# EAGLE design NanjaTown02 (EAGLE 9.2.2)
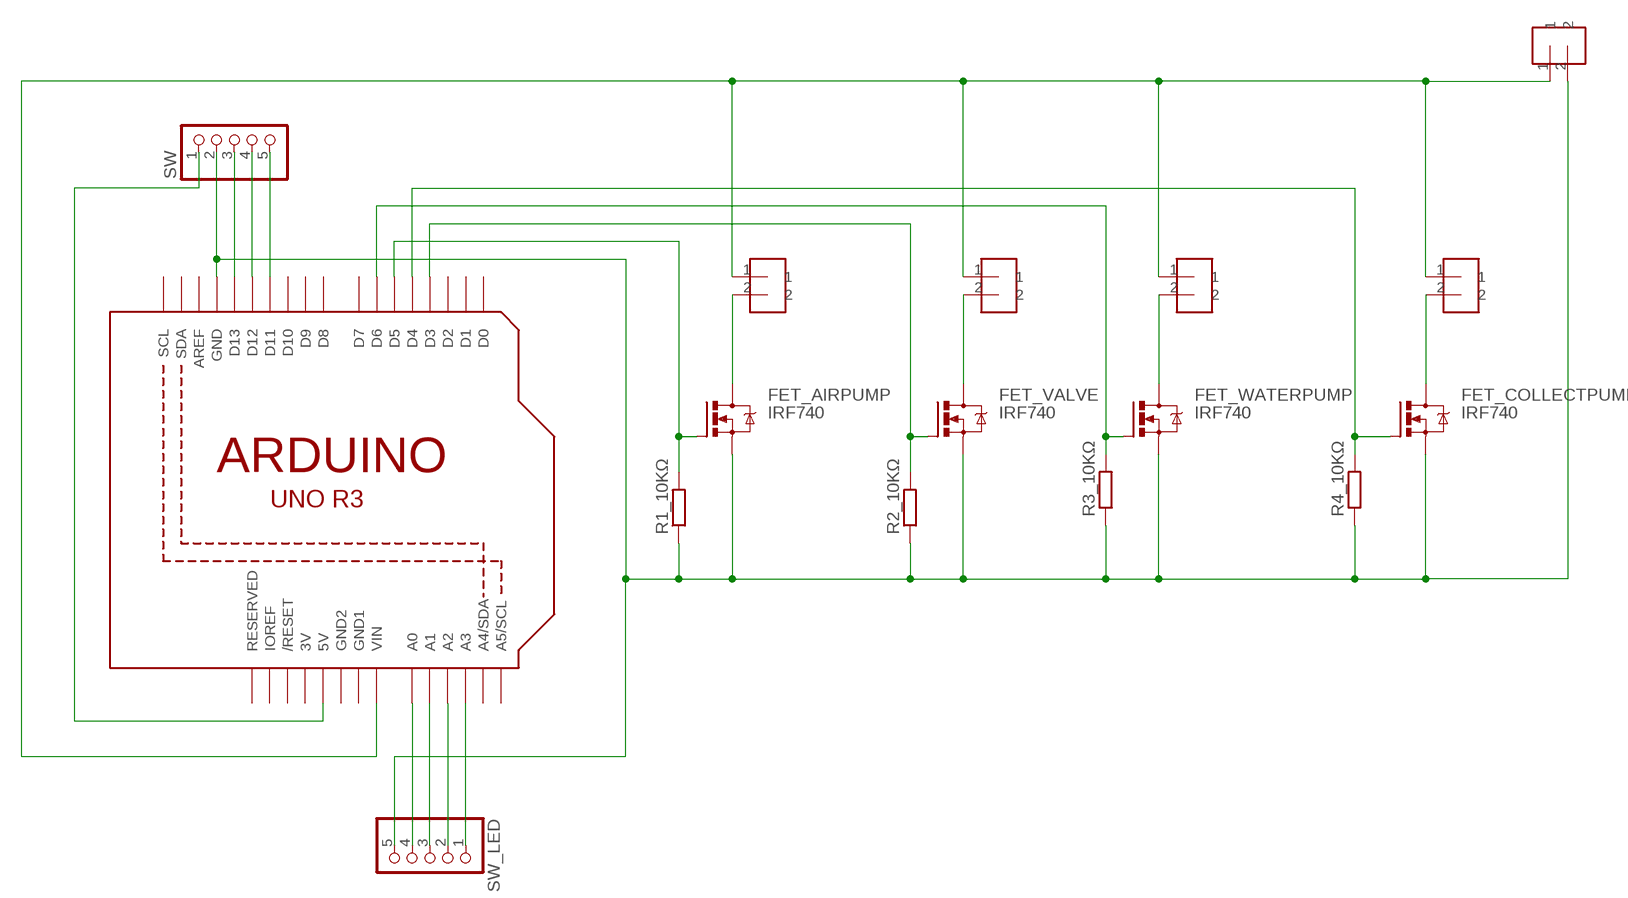
[diagram p0: schematic, sheet 1]

## Parts
FET_AIRPUMP  IRF740  [TO220BV]
FET_COLLECTPUMP  IRF740  [TO220BV]
FET_VALVE  IRF740  [TO220BV]
FET_WATERPUMP  IRF740  [TO220BV]
R1_10KΩ  R-EU_0207/10  [0207/10]
R2_10KΩ  R-EU_0207/10  [0207/10]
R3_10KΩ  R-EU_0207/10  [0207/10]
R4_10KΩ  R-EU_0207/10  [0207/10]
SW  PINHD-1X5  [1X05]
SW_LED  PINHD-1X5/90  [1X05/90]
TERMINAL_AIRPUMP  TERMINAL_BLOCK_5.08MM  [TERMINAL_BLOCK_5.8MM]
TERMINAL_COLLECTPUMP  TERMINAL_BLOCK_5.08MM  [TERMINAL_BLOCK_5.8MM]
TERMINAL_VALVE  TERMINAL_BLOCK_5.08MM  [TERMINAL_BLOCK_5.8MM]
TERMINAL_WATERPUMP  TERMINAL_BLOCK_5.08MM  [TERMINAL_BLOCK_5.8MM]
U1  ARDUINOR3-DIMENSION  [ARDUINOR3]
U$1  TERMINAL_BLOCK_5.08MM  [TERMINAL_BLOCK_5.8MM]

## Nets
N$1: FET_AIRPUMP.G R1_10KΩ.2 U1.D5
N$2: FET_VALVE.G R2_10KΩ.2 U1.D3
N$3: FET_WATERPUMP.G R3_10KΩ.2 U1.D6
N$4: FET_COLLECTPUMP.G R4_10KΩ.2 U1.D4
N$6 [vcc_gnd]: TERMINAL_AIRPUMP.1 TERMINAL_COLLECTPUMP.1 TERMINAL_VALVE.1 TERMINAL_WATERPUMP.1 U1.VIN U$1.1
N$7: FET_AIRPUMP.D TERMINAL_AIRPUMP.2
N$8: FET_VALVE.D TERMINAL_VALVE.2
N$9: FET_WATERPUMP.D TERMINAL_WATERPUMP.2
N$10: FET_COLLECTPUMP.D TERMINAL_COLLECTPUMP.2
N$11: SW_LED.4 U1.A0
N$12: SW_LED.3 U1.A1
N$13: SW_LED.2 U1.A2
N$14: SW_LED.1 U1.A3
N$15 [vcc_gnd]: FET_AIRPUMP.S FET_COLLECTPUMP.S FET_VALVE.S FET_WATERPUMP.S R1_10KΩ.1 R2_10KΩ.1 R3_10KΩ.1 R4_10KΩ.1 SW.2 SW_LED.5 U1.GND U$1.2
N$16: SW.5 U1.D11
N$17: SW.4 U1.D12
N$18: SW.3 U1.D13
N$20: SW.1 U1.5V
Unconnected: U1.A4(A4/SDA) U1.A5(A5/SCL) U1.AREF U1.D0 U1.D1 U1.D2 U1.D7 U1.D8 U1.D9 U1.D10 U1.IOREF U1.RESERVED U1.RESET(/RESET) U1.SCL U1.SDA

## Power pins joined to a net without a drawn wire
3V: U1.3V
GND1: U1.GND1
GND2: U1.GND2

## Library data of the parts
FET_AIRPUMP FET_COLLECTPUMP FET_VALVE FET_WATERPUMP = transistor-power:IRF740: N-CHANNEL MOS FET
R1_10KΩ R2_10KΩ R3_10KΩ R4_10KΩ = rcl:R-EU_: RESISTOR, European symbol; SPICEPREFIX: R
SW SW_LED = pinhead:PINHD-1X5: PIN HEADER
TERMINAL_AIRPUMP TERMINAL_COLLECTPUMP TERMINAL_VALVE TERMINAL_WATERPUMP U$1 = terminal_block_5.08mm:TERMINAL_BLOCK_5.08MM
U1 = adafruit:ARDUINOR3: This is a new object for the new Arduino R3 - with extra pins that you may want to use (such as IOref, and duplicated A4/A5

## Net classes
0 default: width 0.6 mm, clearance 0.4 mm
1 vcc_gnd: width 1 mm, clearance 0.4 mm

## Board
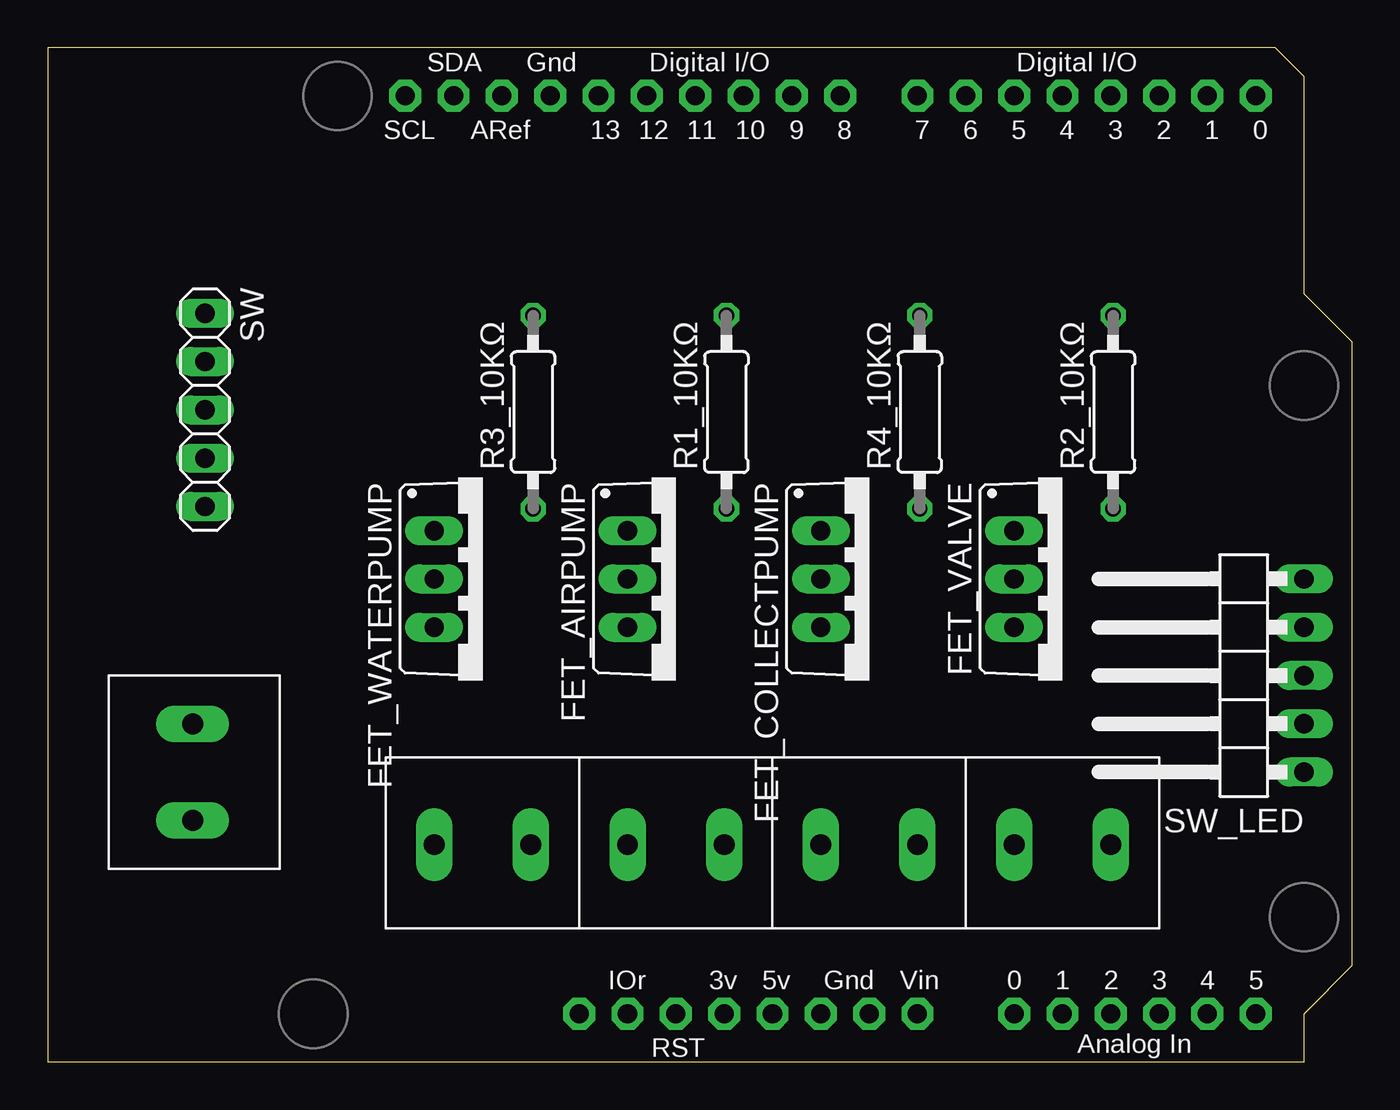
[diagram p1: board, top side]
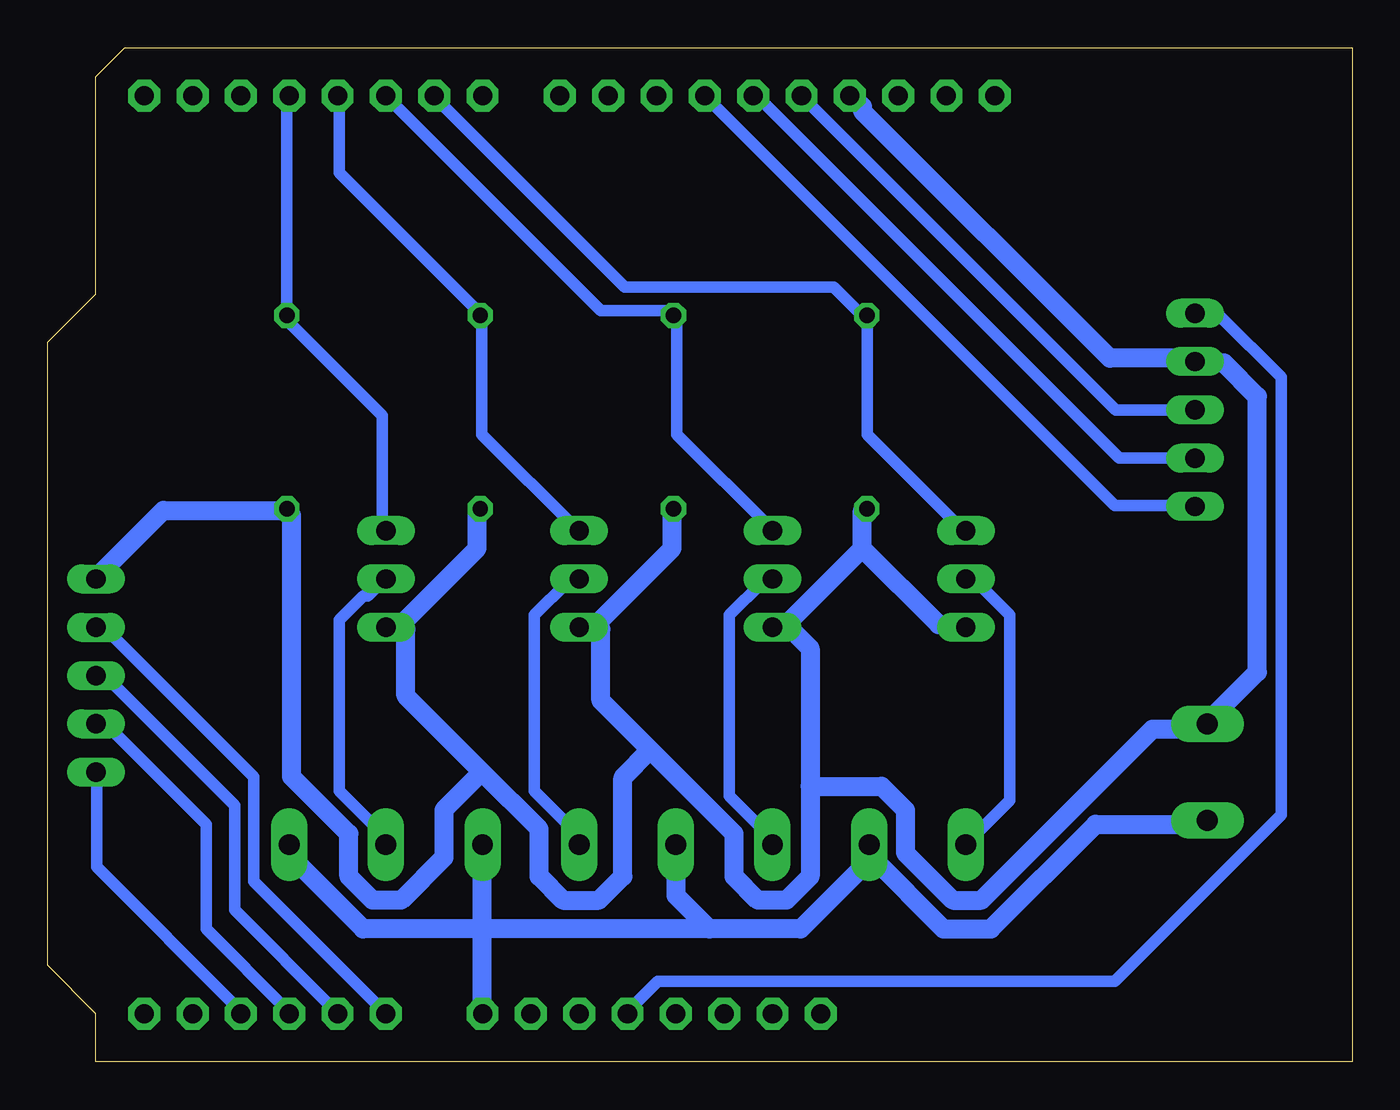
[diagram p2: board, bottom side, seen from below]

Size 68.58 x 53.34 mm. Coordinates in mm from the lower left corner, seen from the top.
Copper layers (1*16): Top 0.035mm / dielectric 1.5mm / Bottom 0.035mm
Design rules "default": minimum track width 6mil, minimum drill 0.35mm, track to track 6mil, track to pad 6mil, pad to pad 6mil, via to via 6mil, smd to smd 6mil, copper to edge 40mil, drill to drill 6mil, minimum pad ring 10mil, minimum via ring 8mil, stop-mask expansion 4mil, vias tented up to drill 0mil, thermal gap 10mil

### Footprints (pad centres in the part's own frame; a part is rotated, then mirrored left to right if it is on the bottom)
TO220BV = drill 1.016 long: D 0,-2.54; G -2.54,-2.54; S 2.54,-2.54
0207/10 = drill 0.813 octagon: 1 -5.08,0; 2 5.08,0
1X05 = drill 1.016 long: 1 -5.08,0; 2 -2.54,0; 3 0,0; 4 2.54,0; 5 5.08,0
1X05/90 = drill 1.016 long: 1 -5.08,-3.81; 2 -2.54,-3.81; 3 0,-3.81; 4 2.54,-3.81; 5 5.08,-3.81
TERMINAL_BLOCK_5.8MM = drill 1.1 pad 1.93 long: 1 0,0; 2 5.08,0
ARDUINOR3 = drill 1 pad 1.676 octagon: 3V 35.56,2.54; 5V 38.1,2.54; A0 50.8,2.54; A1 53.34,2.54; A2 55.88,2.54; A3 58.42,2.54; A4 60.96,2.54; A5 63.5,2.54; AREF 23.876,50.8; D0 63.5,50.8; D1 60.96,50.8; D2 58.42,50.8; D3 55.88,50.8; D4 53.34,50.8; D5 50.8,50.8; D6 48.26,50.8; D7 45.72,50.8; D8 41.656,50.8; D9 39.116,50.8; D10 36.576,50.8; D11 34.036,50.8; D12 31.496,50.8; D13 28.956,50.8; GND 26.416,50.8; GND1 43.18,2.54; GND2 40.64,2.54; IOREF 30.48,2.54; RESERVED 27.94,2.54; RESET 33.02,2.54; SCL 18.796,50.8; SDA 21.336,50.8; VIN 45.72,2.54

### Placement (x,y rotation side)
FET_AIRPUMP  33.02,25.4 270 top
FET_COLLECTPUMP  43.18,25.4 270 top
FET_VALVE  53.34,25.4 270 top
FET_WATERPUMP  22.86,25.4 270 top
R1_10KΩ  35.68,34.17 90 top
R2_10KΩ  56,34.17 90 top
R3_10KΩ  25.52,34.17 90 top
R4_10KΩ  45.84,34.17 90 top
SW  8.27,34.29 270 top
SW_LED  62.23,20.32 90 top
TERMINAL_AIRPUMP  35.56,11.43 180 top
TERMINAL_COLLECTPUMP  45.72,11.43 180 top
TERMINAL_VALVE  55.88,11.43 180 top
TERMINAL_WATERPUMP  25.4,11.43 180 top
U1  0,0 0 top
U$1  7.62,12.7 90 top

### Tracks (layer width: path | path; a pad name or v marks a point on that pad's centre or on a via)
N$1
  Bottom 0.6: FET_AIRPUMP.G 30.5,28 35.5,33 35.5,39.25 R1_10KΩ.2 35.75,39.5 39.5,39.5 U1.D5
N$2
  Bottom 0.6: U1.D3 56,50.75 R2_10KΩ.2 56,39 51,34 51,28 FET_VALVE.G
N$3
  Bottom 0.6: FET_WATERPUMP.G 20.5,28 25.5,33 25.5,39.25 R3_10KΩ.2 25.75,39.25 27.25,40.75 38.25,40.75 48.25,50.75 U1.D6
N$4
  Bottom 0.6: FET_COLLECTPUMP.G 40.75,28 45.75,33 45.75,39.25 R4_10KΩ.2 46,39.5 53.25,46.75 53.25,50.75 U1.D4
N$6
  Bottom 1: 45.75,7 45.75,11.25 TERMINAL_COLLECTPUMP.1 | 45.75,7 45.75,2.75 U1.VIN | 45.75,7 52,7 55.75,10.75 55.75,11.25 TERMINAL_VALVE.1 | U$1.1 7.75,12.5 13.5,12.5 19,7 21.5,7 25.25,10.75 25.25,11.25 TERMINAL_WATERPUMP.1 25.5,10.5 29,7 33.8,7 | 33.8,7 45.75,7 | TERMINAL_AIRPUMP.1 35.56,8.76 33.8,7
N$7
  Bottom 0.6: FET_AIRPUMP.D 30.5,25.25 31,25.25 32.75,23.5 32.75,14 30.25,11.5 TERMINAL_AIRPUMP.2
N$8
  Bottom 0.6: FET_VALVE.D 51,25.25 51.75,24.5 52,24.5 53.25,23.25 53.25,14.25 51,12 51,11.5 TERMINAL_VALVE.2
N$9
  Bottom 0.6: TERMINAL_WATERPUMP.2 18,13.75 18,23.5 19.75,25.25 20.25,25.25 FET_WATERPUMP.D
N$10
  Bottom 0.6: FET_COLLECTPUMP.D 40.75,25.25 41.25,25.25 43,23.5 43,14.25 40.75,12 40.75,11.5 TERMINAL_COLLECTPUMP.2
N$11
  Bottom 0.6: SW_LED.4 66,22.75 65.5,22.75 57.75,15 57.75,9.5 51,2.75 U1.A0
N$12
  Bottom 0.6: SW_LED.3 66,20.25 65.5,20.25 58.75,13.5 58.75,8 53.5,2.75 U1.A1
N$13
  Bottom 0.6: SW_LED.2 66,17.75 65.5,17.75 60.25,12.5 60.25,7 56,2.75 U1.A2
N$14
  Bottom 0.6: SW_LED.1 66,15 66,10.25 58.5,2.75 U1.A3
N$15
  Bottom 1: U1.GND 26.25,50.75 25.75,50.25 25.75,50 12.75,37 8.65,37 SW.2 8.15,36.75 6.75,36.75 5,35 5,20.5 7.5,18 U$1.2 8,17.5 10.5,17.5 19.5,8.5 21,8.5 23.5,11 23.5,13.25 24.75,14.5 28.5,14.5 | SW_LED.5 66,25.5 62.5,29 56,29 R2_10KΩ.1 55.75,28.75 55.75,15 52.75,12 52.75,9.75 51.5,8.5 50,8.5 47.75,10.75 47.75,13.25 45.75,15.25 | R4_10KΩ.1 46,29 46,27 50,23 50.75,23 FET_VALVE.S 49.75,22.75 49.75,19.25 45.75,15.25 | R1_10KΩ.1 35.75,29 35.75,27 39.75,23 40.5,23 FET_COLLECTPUMP.S 39.5,22.75 39.5,19 36.9,16.4 | 25.75,27 25.75,29 R3_10KΩ.1 | 25.75,27 29.75,23 30.25,23 FET_AIRPUMP.S 29.5,22.75 28.5,21.75 28.5,14.5 | 25.75,27 21.75,23 20.5,23 FET_WATERPUMP.S | 36.9,16.4 32.5,12 32.5,9.75 31.25,8.5 29.75,8.5 28.5,9.75 28.5,14.5 | 45.75,15.25 42.75,12.25 42.75,9.75 41.5,8.5 39.6,8.5 38.35,9.75 38.35,14.95 36.9,16.4
N$16
  Bottom 0.6: SW.5 8.4,29.25 12.5,29.25 34,50.75 U1.D11
N$17
  Bottom 0.6: SW.4 12.25,31.75 31.25,50.75 U1.D12
N$18
  Bottom 0.6: SW.3 12.45,34.29 U1.D13
N$20
  Bottom 0.6: SW.1 8.15,39.25 7,39.25 3.75,36 3.75,13 12.5,4.25 36.5,4.25 38,2.75 U1.5V